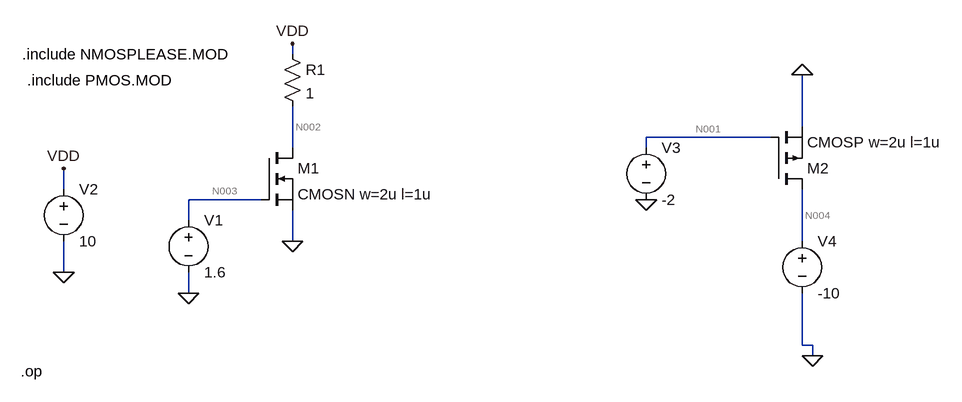
[diagram p0: schematic ProjectTestSchematic.asc]
ProjectTestSchematic.asc, the LTspice schematic file:
Version 4
SHEET 1 1772 712
WIRE 768 208 768 192
WIRE 1552 320 1552 240
WIRE 1504 336 1312 336
WIRE 768 352 768 288
WIRE 1312 352 1312 336
WIRE 416 416 416 384
WIRE 720 432 608 432
WIRE 608 464 608 432
WIRE 768 496 768 448
WIRE 1552 496 1552 416
WIRE 416 544 416 496
WIRE 608 576 608 544
WIRE 1552 656 1552 576
WIRE 1568 656 1552 656
WIRE 1568 672 1568 656
FLAG 416 384 VDD
FLAG 416 544 0
FLAG 608 576 0
FLAG 768 496 0
FLAG 768 192 VDD
FLAG 1552 240 0
FLAG 1568 672 0
FLAG 1312 432 0
DATAFLAG 768 304 ""
SYMBOL /nmos 720 352 R0
SYMATTR InstName M1
SYMATTR Value CMOSN w=2u l=1u
SYMBOL /pmos 1504 416 M180
SYMATTR InstName M2
SYMATTR Value CMOSP w=2u l=1u
SYMBOL voltage 608 448 R0
WINDOW 123 0 0 Left 0
WINDOW 39 0 0 Left 0
SYMATTR InstName V1
SYMATTR Value 1.6
SYMBOL res 752 192 R0
SYMATTR InstName R1
SYMATTR Value 1
SYMBOL voltage 416 400 R0
WINDOW 123 0 0 Left 0
WINDOW 39 0 0 Left 0
SYMATTR InstName V2
SYMATTR Value 10
SYMBOL voltage 1312 336 R0
WINDOW 123 0 0 Left 0
WINDOW 39 0 0 Left 0
SYMATTR InstName V3
SYMATTR Value -2
SYMBOL voltage 1552 480 R0
WINDOW 123 0 0 Left 0
WINDOW 39 0 0 Left 0
SYMATTR InstName V4
SYMATTR Value -10
TEXT 352 208 Left 2 !.include NMOSPLEASE.MOD
TEXT 360 248 Left 2 !.include PMOS.MOD
TEXT 350 696 Left 2 !.op

The netlist it stands for:
* ProjectTestSchematic.asc
M1 N002 N003 0 0 CMOSN w=2u l=1u
M2 N004 N001 0 0 CMOSP w=2u l=1u
V1 N003 0 1.6
R1 VDD N002 1
V2 VDD 0 10
V3 N001 0 -2
V4 N004 0 -10
.model NMOS NMOS
.model PMOS PMOS
.lib standard.mos
.include NMOSPLEASE.MOD
.include PMOS.MOD
.op
.backanno
.end

* Results of the author's LTspice run, read from the files saved beside the schematic
* Operating Point:
*   V(n002) = 10 V
*   V(n003) = 1.6 V
*   V(n004) = -10 V
*   V(n001) = -2 V
*   V(vdd) = 10 V
*   Id(M2) = -161.6 µA
*   Ig(M2) = 0 A
*   Ib(M2) = 10.01 pA
*   Is(M2) = 161.6 µA
*   Id(M1) = 220.5 µA
*   Ig(M1) = 0 A
*   Ib(M1) = -10.01 pA
*   Is(M1) = -220.5 µA
*   I(R1) = 220.5 µA
*   I(V4) = 161.6 µA
*   I(V3) = 0 A
*   I(V2) = -220.5 µA
*   I(V1) = 0 A
* From the log:
*   Semiconductor Device Operating Points:
*                           --- MOSFET Transistors ---
*   Name:          m2          m1
*   Model:        cmosp       cmosn
*   Id:         -1.62e-04    2.21e-04
*   Vgs:        -2.00e+00    1.60e+00
*   Vds:        -1.00e+01    1.00e+01
*   Vbs:         0.00e+00    0.00e+00
*   Vth:        -7.40e-01    6.32e-01
*   Vdsat:      -1.07e+00    7.98e-01
*   Gm:          2.39e-04    4.30e-04
*   Gds:         1.08e-05    9.97e-06
*   Gmb:         5.66e-05    1.20e-04
*   Cbd:         0.00e+00    0.00e+00
*   Cbs:         0.00e+00    0.00e+00
*   Cgsov:       1.08e-16    8.05e-16
*   Cgdov:       1.08e-16    8.05e-16
*   Cgbov:       3.36e-16    3.61e-16
*   Cgs:         6.14e-15    6.39e-15
*   Cgd:         0.00e+00    0.00e+00
*   Cgb:         0.00e+00    0.00e+00